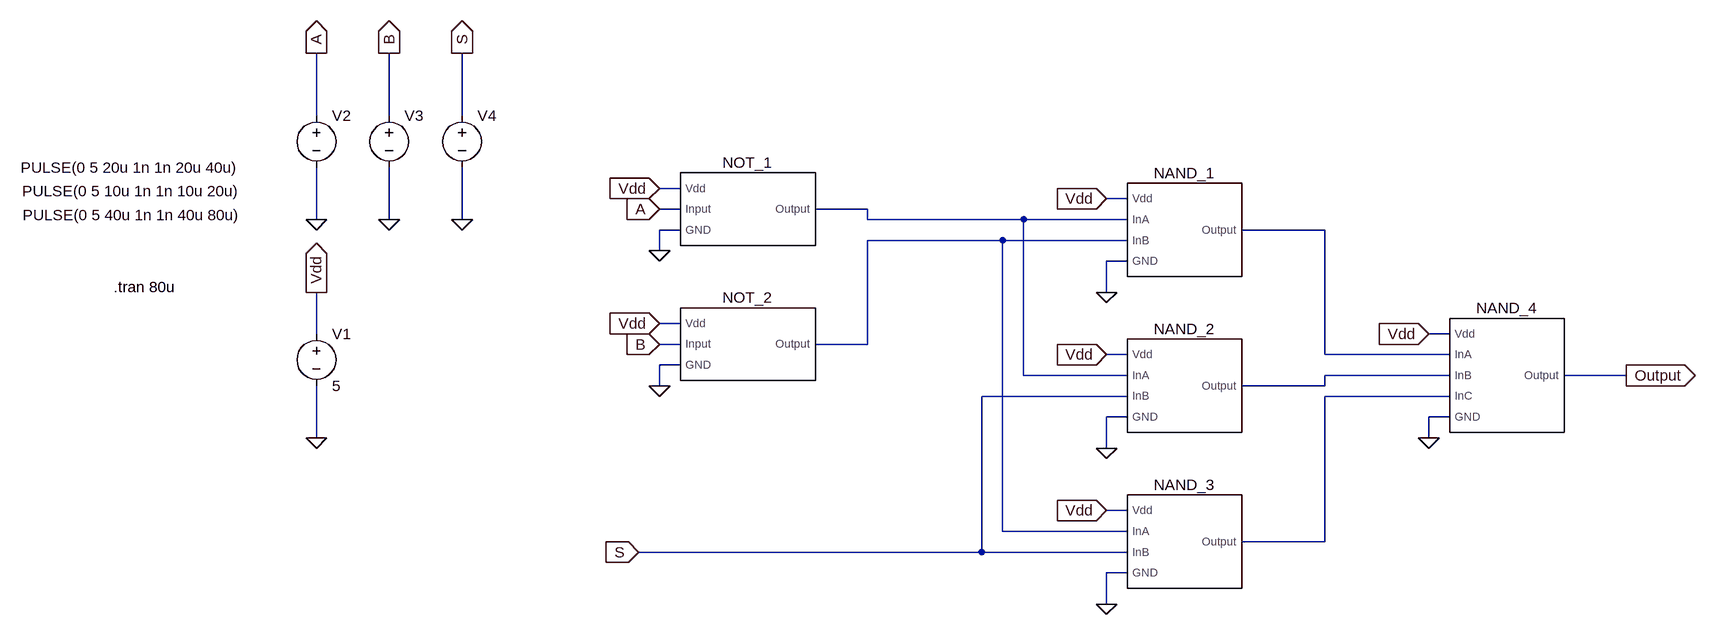
[diagram p0: schematic PLB_with_NMOS_PMOS.asc]
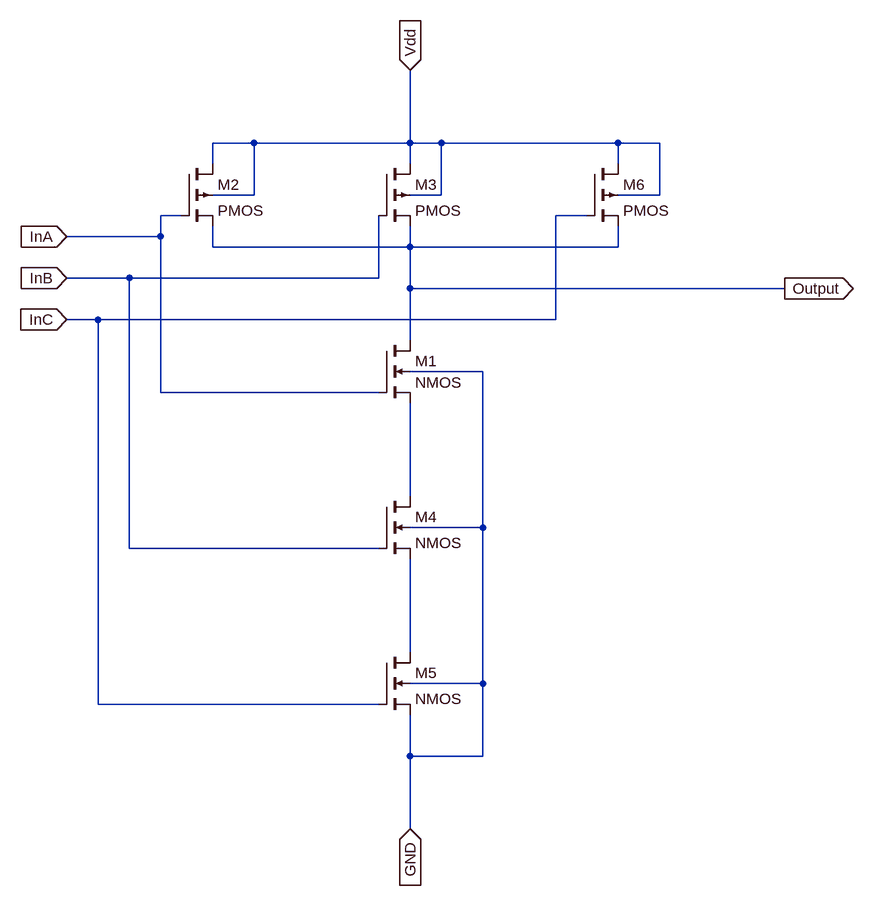
[diagram p1: sub-circuit nand3.asc]
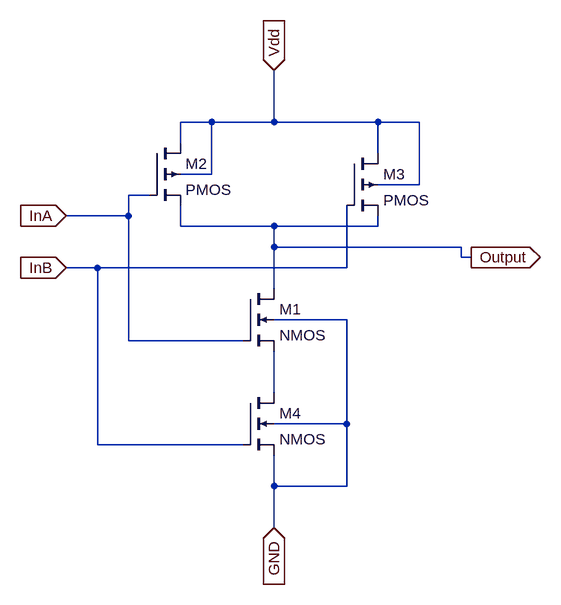
[diagram p2: sub-circuit nand2.asc]
PLB_with_NMOS_PMOS.asc, the LTspice schematic file:
Version 4
SHEET 1 1700 680
WIRE -864 -384 -864 -480
WIRE -752 -384 -752 -480
WIRE -640 -384 -640 -480
WIRE -304 -272 -336 -272
WIRE 384 -256 352 -256
WIRE -304 -240 -336 -240
WIRE -16 -240 -96 -240
WIRE -864 -224 -864 -304
WIRE -752 -224 -752 -304
WIRE -640 -224 -640 -304
WIRE -16 -224 -16 -240
WIRE 224 -224 -16 -224
WIRE 384 -224 224 -224
WIRE -304 -208 -336 -208
WIRE 688 -208 560 -208
WIRE 192 -192 -16 -192
WIRE 384 -192 192 -192
WIRE -336 -176 -336 -208
WIRE 384 -160 352 -160
WIRE 352 -112 352 -160
WIRE -304 -64 -336 -64
WIRE -864 -48 -864 -112
WIRE 880 -48 848 -48
WIRE -304 -32 -336 -32
WIRE -16 -32 -16 -192
WIRE -16 -32 -96 -32
WIRE 384 -16 352 -16
WIRE 688 -16 688 -208
WIRE 880 -16 688 -16
WIRE -304 0 -336 0
WIRE 224 16 224 -224
WIRE 384 16 224 16
WIRE 880 16 688 16
WIRE 1152 16 1056 16
WIRE -336 32 -336 0
WIRE 688 32 688 16
WIRE 688 32 560 32
WIRE 384 48 160 48
WIRE 880 48 688 48
WIRE 384 80 352 80
WIRE 880 80 848 80
WIRE -864 112 -864 32
WIRE 848 112 848 80
WIRE 352 128 352 80
WIRE 384 224 352 224
WIRE 192 256 192 -192
WIRE 384 256 192 256
WIRE 688 272 688 48
WIRE 688 272 560 272
WIRE 160 288 160 48
WIRE 160 288 -368 288
WIRE 384 288 160 288
WIRE 384 320 352 320
WIRE 352 368 352 320
FLAG -864 -224 0
FLAG -752 -224 0
FLAG -640 -224 0
FLAG -864 -480 A
IOPIN -864 -480 Out
FLAG -752 -480 B
IOPIN -752 -480 Out
FLAG -640 -480 S
IOPIN -640 -480 Out
FLAG 1152 16 Output
IOPIN 1152 16 Out
FLAG -864 112 0
FLAG -864 -112 Vdd
IOPIN -864 -112 Out
FLAG -336 -272 Vdd
IOPIN -336 -272 In
FLAG -336 -64 Vdd
IOPIN -336 -64 In
FLAG 352 -256 Vdd
IOPIN 352 -256 In
FLAG 352 -16 Vdd
IOPIN 352 -16 In
FLAG 352 224 Vdd
IOPIN 352 224 In
FLAG 848 -48 Vdd
IOPIN 848 -48 In
FLAG -336 -240 A
IOPIN -336 -240 In
FLAG -336 -32 B
IOPIN -336 -32 In
FLAG 352 -112 0
FLAG 352 128 0
FLAG 352 368 0
FLAG 848 112 0
FLAG -336 32 0
FLAG -336 -176 0
FLAG -368 288 S
IOPIN -368 288 In
SYMBOL voltage -864 -400 R0
WINDOW 3 -455 96 Left 2
WINDOW 123 0 0 Left 0
WINDOW 39 0 0 Left 0
SYMATTR Value PULSE(0 5 20u 1n 1n 20u 40u)
SYMATTR InstName V2
SYMBOL voltage -752 -400 R0
WINDOW 3 -565 132 Left 2
WINDOW 123 0 0 Left 0
WINDOW 39 0 0 Left 0
SYMATTR Value PULSE(0 5 10u 1n 1n 10u 20u)
SYMATTR InstName V3
SYMBOL voltage -640 -400 R0
WINDOW 3 -676 169 Left 2
WINDOW 123 0 0 Left 0
WINDOW 39 0 0 Left 0
SYMATTR Value PULSE(0 5 40u 1n 1n 40u 80u)
SYMATTR InstName V4
SYMBOL Nand3 960 16 R0
SYMATTR InstName NAND_4
SYMBOL Nand2 464 -208 R0
SYMATTR InstName NAND_1
SYMBOL Nand2 464 32 R0
SYMATTR InstName NAND_2
SYMBOL Nand2 464 272 R0
SYMATTR InstName NAND_3
SYMBOL Not2 -208 -240 R0
SYMATTR InstName NOT_1
SYMBOL Not2 -208 -32 R0
SYMATTR InstName NOT_2
SYMBOL voltage -864 -64 R0
WINDOW 123 0 0 Left 0
WINDOW 39 0 0 Left 0
SYMATTR InstName V1
SYMATTR Value 5
TEXT -1176 -120 Left 2 !.tran 80u

nand3.asc, the sub-circuit schematic file:
Version 4
SHEET 1 892 1328
WIRE -240 144 -304 144
WIRE 0 144 0 32
WIRE 0 144 -240 144
WIRE 48 144 0 144
WIRE 320 144 48 144
WIRE 384 144 320 144
WIRE -304 176 -304 144
WIRE 0 176 0 144
WIRE 320 176 320 144
WIRE -240 224 -240 144
WIRE -240 224 -304 224
WIRE 48 224 48 144
WIRE 48 224 0 224
WIRE 384 224 384 144
WIRE 384 224 320 224
WIRE -352 256 -384 256
WIRE 272 256 224 256
WIRE -384 288 -384 256
WIRE -384 288 -528 288
WIRE -304 304 -304 272
WIRE 0 304 0 272
WIRE 0 304 -304 304
WIRE 320 304 320 272
WIRE 320 304 0 304
WIRE -432 352 -528 352
WIRE -48 352 -48 256
WIRE -48 352 -432 352
WIRE 0 368 0 304
WIRE 576 368 0 368
WIRE -480 416 -528 416
WIRE 224 416 224 256
WIRE 224 416 -480 416
WIRE 0 448 0 368
WIRE 112 496 0 496
WIRE -384 528 -384 288
WIRE -48 528 -384 528
WIRE 0 688 0 544
WIRE 112 736 112 496
WIRE 112 736 0 736
WIRE -432 768 -432 352
WIRE -48 768 -432 768
WIRE 0 928 0 784
WIRE 112 976 112 736
WIRE 112 976 0 976
WIRE -480 1008 -480 416
WIRE -48 1008 -480 1008
WIRE 0 1088 0 1024
WIRE 112 1088 112 976
WIRE 112 1088 0 1088
WIRE 0 1200 0 1088
FLAG -528 288 InA
IOPIN -528 288 In
FLAG -528 352 InB
IOPIN -528 352 In
FLAG 0 32 Vdd
IOPIN 0 32 In
FLAG 576 368 Output
IOPIN 576 368 Out
FLAG -528 416 InC
IOPIN -528 416 In
FLAG 0 1200 GND
IOPIN 0 1200 In
SYMBOL pmos4 -352 176 R0
SYMATTR InstName M2
SYMBOL pmos4 -48 176 R0
SYMATTR InstName M3
SYMBOL nmos4 -48 448 R0
WINDOW 3 56 65 Left 2
SYMATTR InstName M1
SYMBOL nmos4 -48 688 R0
SYMATTR InstName M4
SYMBOL nmos4 -48 928 R0
SYMATTR InstName M5
SYMBOL pmos4 272 176 R0
SYMATTR InstName M6

nand2.asc, the sub-circuit schematic file:
Version 4
SHEET 1 880 944
WIRE -256 144 -304 144
WIRE -160 144 -160 64
WIRE -160 144 -256 144
WIRE 0 144 -160 144
WIRE 64 144 0 144
WIRE -304 176 -304 144
WIRE 0 192 0 144
WIRE -256 224 -256 144
WIRE -256 224 -304 224
WIRE 64 240 64 144
WIRE 64 240 0 240
WIRE -352 256 -384 256
WIRE -384 288 -384 256
WIRE -384 288 -480 288
WIRE -304 304 -304 272
WIRE -160 304 -304 304
WIRE 0 304 0 288
WIRE 0 304 -160 304
WIRE -160 336 -160 304
WIRE 128 336 -160 336
WIRE 128 352 128 336
WIRE 144 352 128 352
WIRE -432 368 -480 368
WIRE -48 368 -48 272
WIRE -48 368 -432 368
WIRE -160 400 -160 336
WIRE -48 448 -160 448
WIRE -384 480 -384 288
WIRE -208 480 -384 480
WIRE -160 560 -160 496
WIRE -48 608 -48 448
WIRE -48 608 -160 608
WIRE -432 640 -432 368
WIRE -208 640 -432 640
WIRE -160 704 -160 656
WIRE -48 704 -48 608
WIRE -48 704 -160 704
WIRE -160 768 -160 704
FLAG -480 288 InA
IOPIN -480 288 In
FLAG -480 368 InB
IOPIN -480 368 In
FLAG -160 768 GND
IOPIN -160 768 In
FLAG -160 64 Vdd
IOPIN -160 64 In
FLAG 144 352 Output
IOPIN 144 352 Out
SYMBOL pmos4 -352 176 R0
SYMATTR InstName M2
SYMBOL pmos4 -48 192 R0
SYMATTR InstName M3
SYMBOL nmos4 -208 400 R0
SYMATTR InstName M1
SYMBOL nmos4 -208 560 R0
SYMATTR InstName M4

The netlist it stands for:
* PLB_with_NMOS_PMOS.asc
V2 A 0 PULSE(0 5 20u 1n 1n 20u 40u)
V3 B 0 PULSE(0 5 10u 1n 1n 10u 20u)
V4 S 0 PULSE(0 5 40u 1n 1n 40u 80u)
XNAND_4 0 N002 N004 N005 Vdd Output nand3
XNAND_1 0 N001 N003 Vdd N002 nand2
XNAND_2 0 N001 S Vdd N004 nand2
XNAND_3 0 N003 S Vdd N005 nand2
XNOT_1 0 A Vdd N001 Not2  ; pins GND Input Vdd Output
XNOT_2 0 B Vdd N003 Not2  ; pins GND Input Vdd Output
V1 Vdd 0 5

* block symbol definitions
.subckt nand3 GND InA InB InC Vdd Output
M2 Vdd InA Output Vdd PMOS
M3 Vdd InB Output Vdd PMOS
M1 Output InA N001 GND NMOS
M4 N001 InB N002 GND NMOS
M5 N002 InC GND GND NMOS
M6 Vdd InC Output Vdd PMOS
.ends nand3

.subckt nand2 GND InA InB Vdd Output
M2 Vdd InA Output Vdd PMOS
M3 Vdd InB Output Vdd PMOS
M1 Output InA N001 GND NMOS
M4 N001 InB GND GND NMOS
.ends nand2

.model NMOS NMOS
.model PMOS PMOS
.lib standard.mos
.tran 80u
.backanno
.end